# Altium schematic sheet Top.SchDoc: Top
size A4; Date: Not used; ApprovedBy: Not used; CheckedBy: Not used; Author: Not used; CompanyName: STMicroelectronics; DrawnBy: Not used; Engineer: Not used; Organization: Not used; Address1: Not used; Address2: Not used; Address3: Not used; Address4: Not used; DocumentNumber: Not used; Revision: Not used; SheetNumber: 2; SheetTotal: 8; CurrentTime: Not used; CurrentDate: Not used; Time: Not used; DocumentFullPathAndName: Not used; DocumentName: Not used; ModifiedDate: Not used; ImagePath: Not used; ProjectName: Not used; Application_BuildNumber: Not used
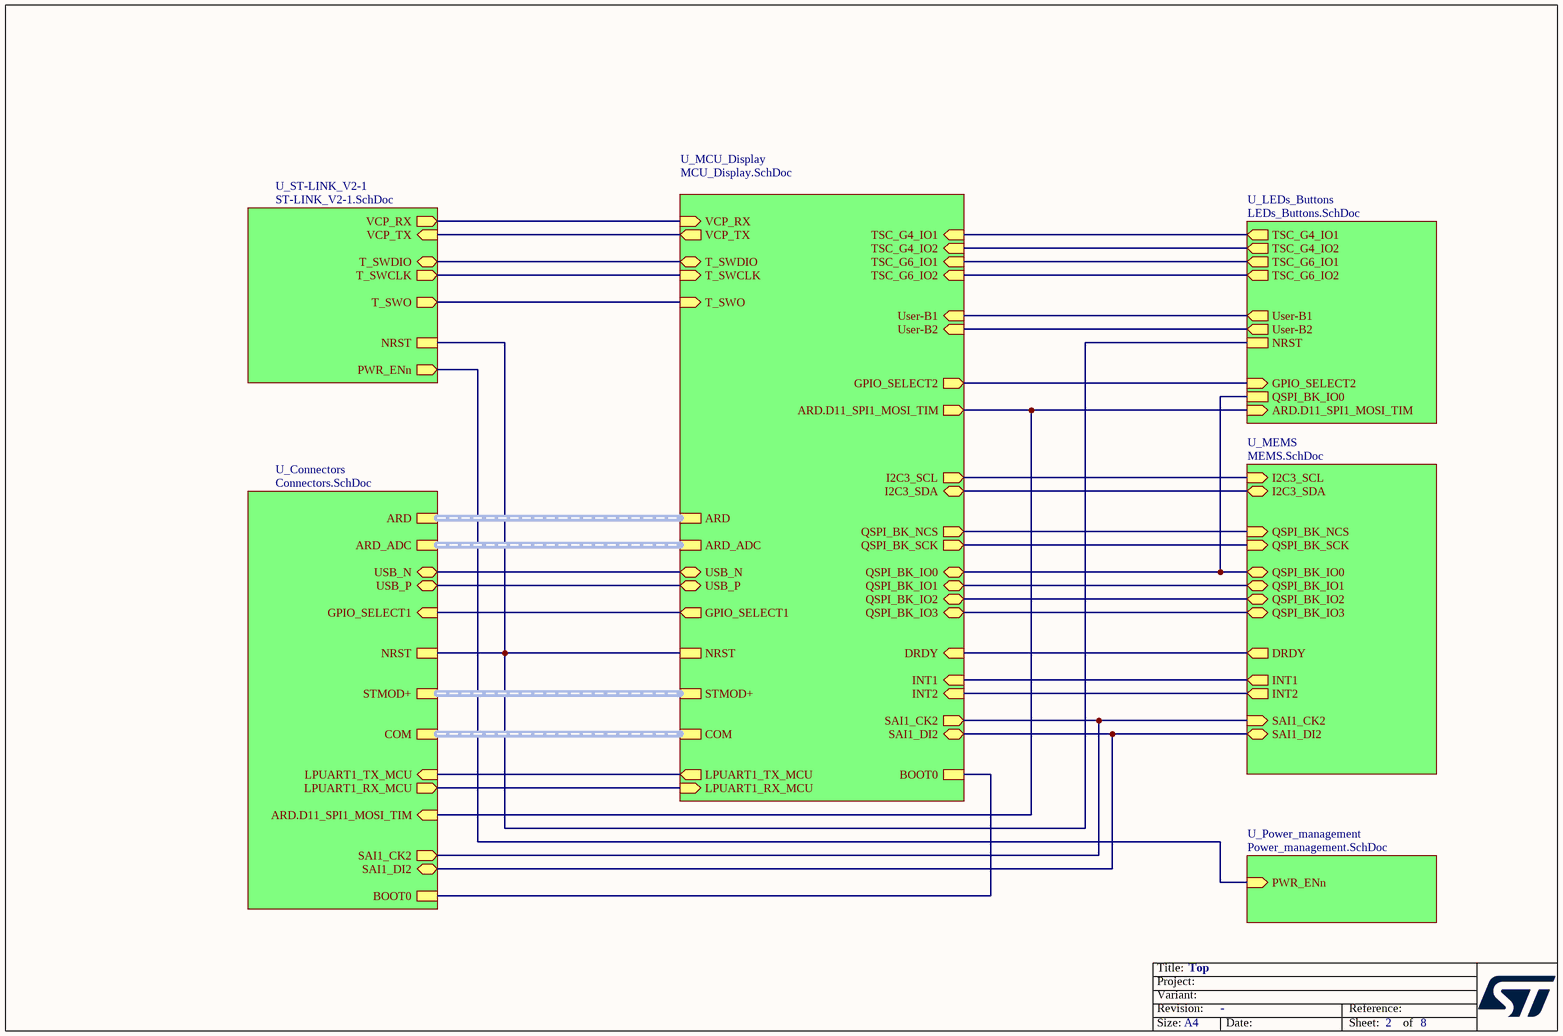
[diagram p0: Top.SchDoc]

## Sub-sheets
U_Connectors = Connectors.SchDoc: ARD (harness ARD), ARD_ADC (harness ARD_ADC), USB_P (bidir), USB_N (bidir), GPIO_SELECT1 (in), NRST, STMOD+ (harness STMOD+), COM (harness COM), LPUART1_TX_MCU (in), LPUART1_RX_MCU (out), ARD.D11_SPI1_MOSI_TIM (in), SAI1_CK2 (out), SAI1_DI2 (bidir), BOOT0
U_LEDs_Buttons = LEDs_Buttons.SchDoc: TSC_G4_IO1 (out), TSC_G4_IO2 (out), TSC_G6_IO1 (out), TSC_G6_IO2 (out), User-B1 (out), User-B2 (out), NRST, GPIO_SELECT2 (in), ARD.D11_SPI1_MOSI_TIM (in), QSPI_BK_IO0
U_MCU_Display = MCU_Display.SchDoc: ARD (harness ARD), ARD_ADC (harness ARD_ADC), USB_P (bidir), USB_N (bidir), GPIO_SELECT1 (out), NRST, TSC_G4_IO1 (in), TSC_G4_IO2 (in), TSC_G6_IO1 (in), TSC_G6_IO2 (in), T_SWDIO (bidir), T_SWCLK (in), T_SWO (in), I2C3_SDA (bidir), I2C3_SCL (out), QSPI_BK_NCS (out), QSPI_BK_SCK (out), QSPI_BK_IO0 (bidir), QSPI_BK_IO1 (bidir), QSPI_BK_IO2 (bidir), QSPI_BK_IO3 (bidir), DRDY (in), INT1 (in), SAI1_CK2 (out), SAI1_DI2 (bidir), User-B1 (in), User-B2 (in), GPIO_SELECT2 (out), STMOD+ (harness STMOD+), ARD.D11_SPI1_MOSI_TIM (out), COM (harness COM), LPUART1_TX_MCU (out), LPUART1_RX_MCU (in), VCP_RX (in), VCP_TX (out), INT2 (in), BOOT0
U_MEMS = MEMS.SchDoc: I2C3_SCL (in), I2C3_SDA (bidir), QSPI_BK_NCS (in), QSPI_BK_SCK (in), QSPI_BK_IO0 (bidir), QSPI_BK_IO1 (bidir), QSPI_BK_IO2 (bidir), QSPI_BK_IO3 (bidir), DRDY (out), INT1 (out), SAI1_CK2 (in), SAI1_DI2 (bidir), INT2 (out)
U_Power_management = Power_management.SchDoc: PWR_ENn (in)
U_ST-LINK_V2-1 = ST-LINK_V2-1.SchDoc: VCP_TX (in), VCP_RX (out), NRST, T_SWDIO (bidir), T_SWCLK (out), T_SWO (out), PWR_ENn (out)

## Nets
(unnamed): sheet U_ST-LINK_V2-1/VCP_TX, sheet U_MCU_Display/VCP_TX
(unnamed): sheet U_ST-LINK_V2-1/VCP_RX, sheet U_MCU_Display/VCP_RX
(unnamed): sheet U_ST-LINK_V2-1/NRST, sheet U_Connectors/NRST, sheet U_MCU_Display/NRST, sheet U_LEDs_Buttons/NRST
(unnamed): sheet U_ST-LINK_V2-1/T_SWDIO, sheet U_MCU_Display/T_SWDIO
(unnamed): sheet U_ST-LINK_V2-1/T_SWCLK, sheet U_MCU_Display/T_SWCLK
(unnamed): sheet U_ST-LINK_V2-1/T_SWO, sheet U_MCU_Display/T_SWO
(unnamed): sheet U_ST-LINK_V2-1/PWR_ENn, sheet U_Power_management/PWR_ENn
(unnamed): sheet U_Connectors/USB_P, sheet U_MCU_Display/USB_P
(unnamed): sheet U_Connectors/USB_N, sheet U_MCU_Display/USB_N
(unnamed): sheet U_Connectors/GPIO_SELECT1, sheet U_MCU_Display/GPIO_SELECT1
(unnamed): sheet U_Connectors/LPUART1_TX_MCU, sheet U_MCU_Display/LPUART1_TX_MCU
(unnamed): sheet U_Connectors/LPUART1_RX_MCU, sheet U_MCU_Display/LPUART1_RX_MCU
(unnamed): sheet U_Connectors/ARD.D11_SPI1_MOSI_TIM, sheet U_MCU_Display/ARD.D11_SPI1_MOSI_TIM, sheet U_LEDs_Buttons/ARD.D11_SPI1_MOSI_TIM
(unnamed): sheet U_Connectors/SAI1_CK2, sheet U_MEMS/SAI1_CK2, sheet U_MCU_Display/SAI1_CK2
(unnamed): sheet U_Connectors/SAI1_DI2, sheet U_MEMS/SAI1_DI2, sheet U_MCU_Display/SAI1_DI2
(unnamed): sheet U_Connectors/BOOT0, sheet U_MCU_Display/BOOT0
(unnamed): sheet U_MEMS/I2C3_SCL, sheet U_MCU_Display/I2C3_SCL
(unnamed): sheet U_MEMS/I2C3_SDA, sheet U_MCU_Display/I2C3_SDA
(unnamed): sheet U_MEMS/QSPI_BK_NCS, sheet U_MCU_Display/QSPI_BK_NCS
(unnamed): sheet U_MEMS/QSPI_BK_SCK, sheet U_MCU_Display/QSPI_BK_SCK
(unnamed): sheet U_MEMS/QSPI_BK_IO0, sheet U_MCU_Display/QSPI_BK_IO0, sheet U_LEDs_Buttons/QSPI_BK_IO0
(unnamed): sheet U_MEMS/QSPI_BK_IO1, sheet U_MCU_Display/QSPI_BK_IO1
(unnamed): sheet U_MEMS/QSPI_BK_IO2, sheet U_MCU_Display/QSPI_BK_IO2
(unnamed): sheet U_MEMS/QSPI_BK_IO3, sheet U_MCU_Display/QSPI_BK_IO3
(unnamed): sheet U_MEMS/DRDY, sheet U_MCU_Display/DRDY
(unnamed): sheet U_MEMS/INT1, sheet U_MCU_Display/INT1
(unnamed): sheet U_MEMS/INT2, sheet U_MCU_Display/INT2
(unnamed): sheet U_MCU_Display/TSC_G4_IO1, sheet U_LEDs_Buttons/TSC_G4_IO1
(unnamed): sheet U_MCU_Display/TSC_G4_IO2, sheet U_LEDs_Buttons/TSC_G4_IO2
(unnamed): sheet U_MCU_Display/TSC_G6_IO1, sheet U_LEDs_Buttons/TSC_G6_IO1
(unnamed): sheet U_MCU_Display/TSC_G6_IO2, sheet U_LEDs_Buttons/TSC_G6_IO2
(unnamed): sheet U_MCU_Display/User-B1, sheet U_LEDs_Buttons/User-B1
(unnamed): sheet U_MCU_Display/User-B2, sheet U_LEDs_Buttons/User-B2
(unnamed): sheet U_MCU_Display/GPIO_SELECT2, sheet U_LEDs_Buttons/GPIO_SELECT2

## Buses and harness runs
harness sheet U_Connectors/ARD = sheet U_MCU_Display/ARD
harness sheet U_Connectors/ARD_ADC = sheet U_MCU_Display/ARD_ADC
harness sheet U_Connectors/COM = sheet U_MCU_Display/COM
harness sheet U_Connectors/STMOD+ = sheet U_MCU_Display/STMOD+

## Notes on the sheet
- Title:
- Project:
- Size:
- Revision:
- Variant:
- A4
- -
- Date:
- Reference:
- Sheet:
- of